# EAGLE schematic hat_raspi_7segdis (EAGLE 9.6.2)
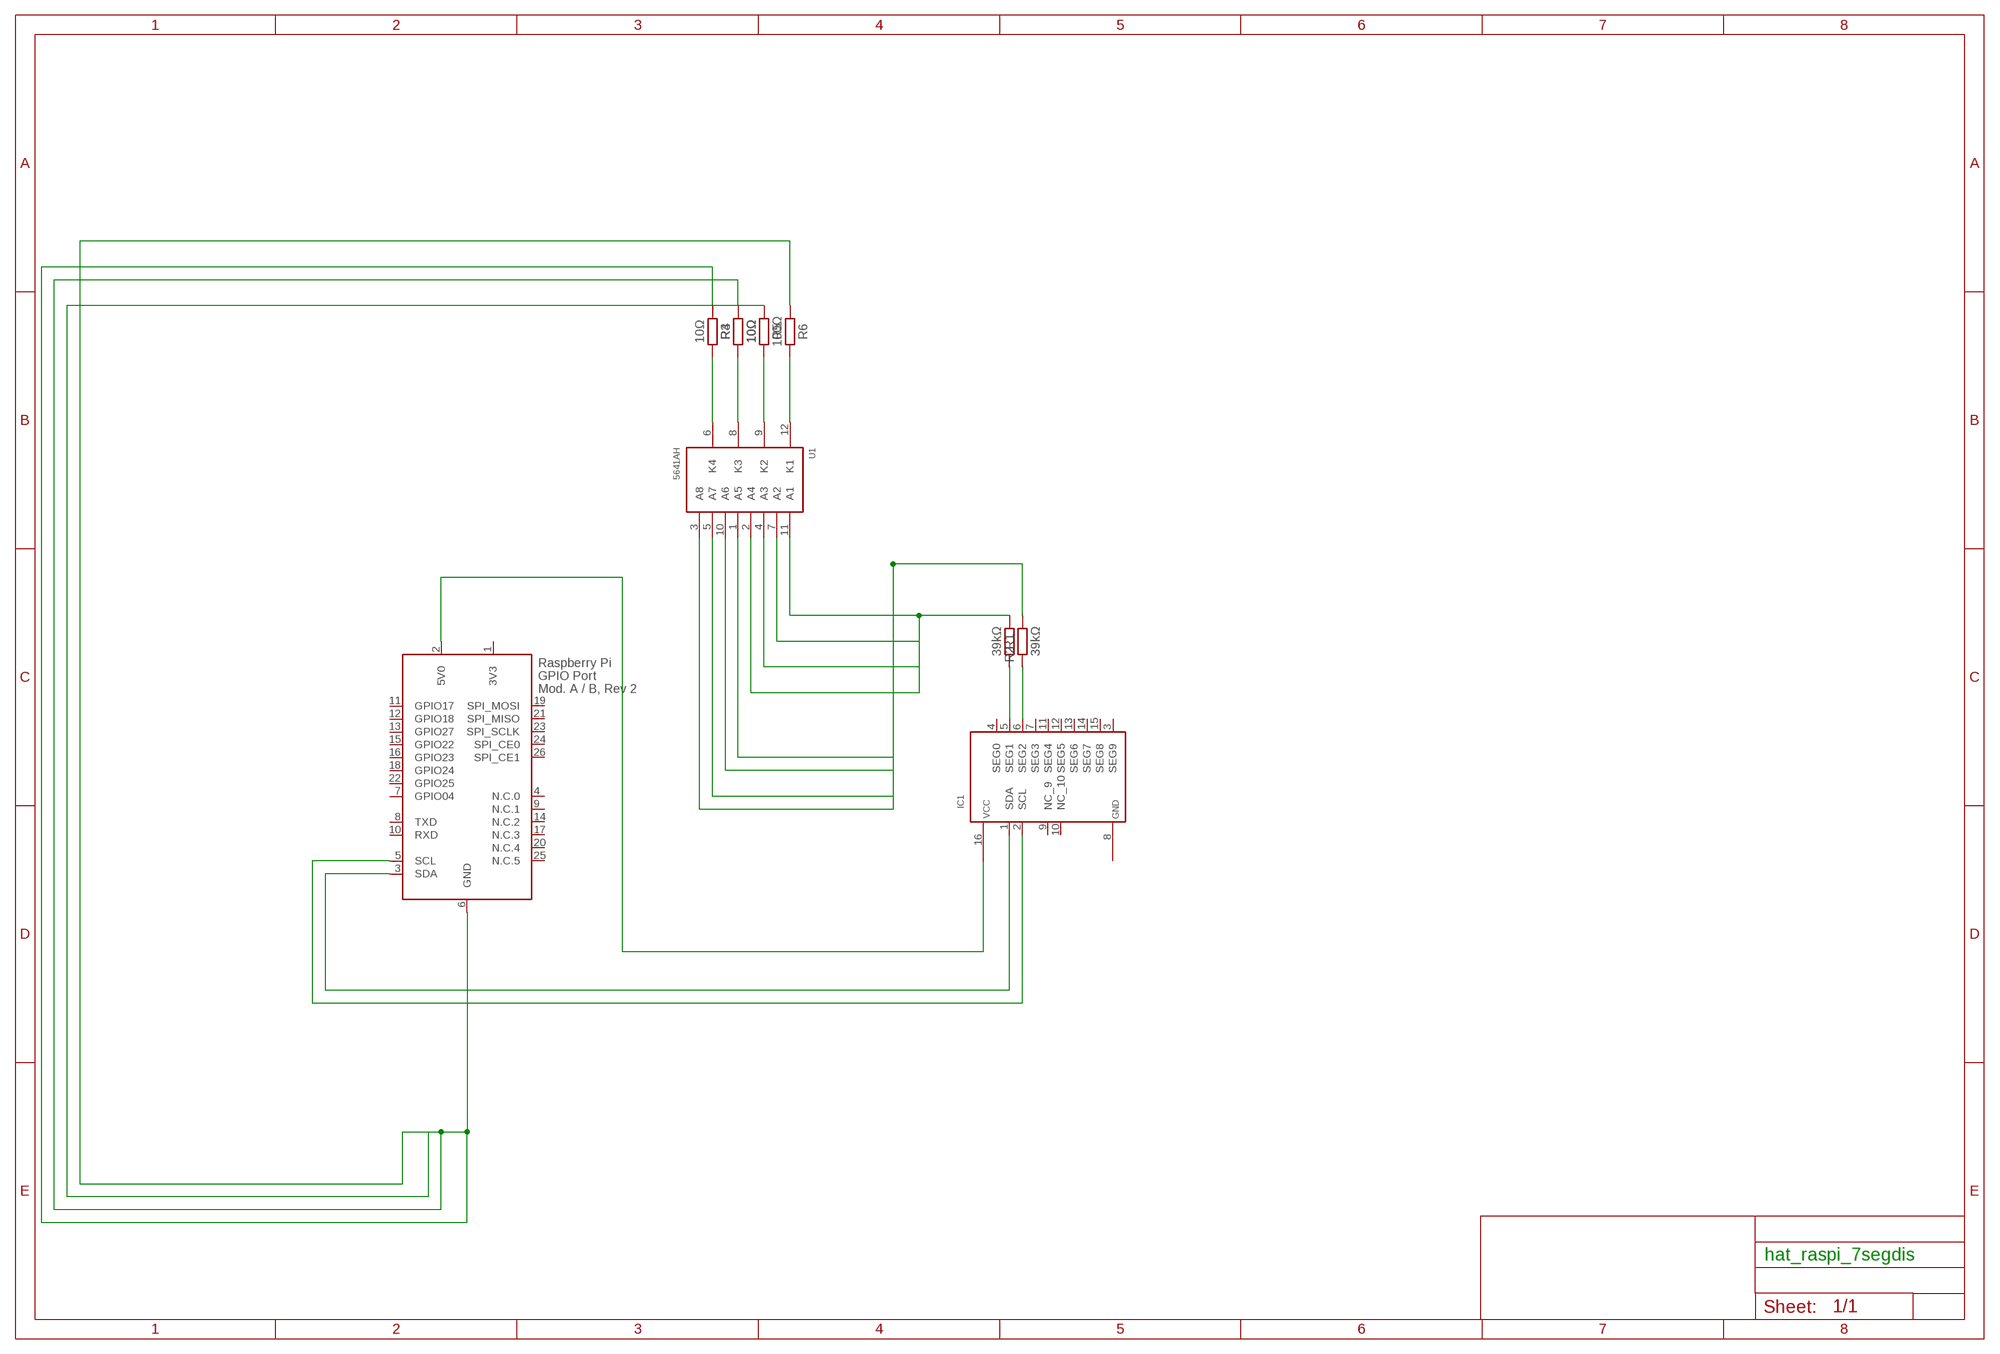
[diagram p0: schematic, sheet 1]

## Parts
IC1  MAX6958  [QSOP16]
R1  39kΩ  R_AXIAL-7.2MM-PITCH  [RESAD724W46L381D178B]
R2  39kΩ  R_AXIAL-7.2MM-PITCH  [RESAD724W46L381D178B]
R3  10Ω  R_AXIAL-7.2MM-PITCH  [RESAD724W46L381D178B]
R4  10Ω  R_AXIAL-7.2MM-PITCH  [RESAD724W46L381D178B]
R5  10Ω  R_AXIAL-7.2MM-PITCH  [RESAD724W46L381D178B]
R6  100Ω  R_AXIAL-7.2MM-PITCH  [RESAD724W46L381D178B]
U1  5641AH  [5642AH]
X1  RASPI_BOARD_AB_E2P  [RASPI_BOARD_AB_EDGES_2DRILL_PAD]

## Nets
N$1: R4.2 U1.6(K4)
N$2: R3.1 U1.8(K3)
N$3: R5.2 U1.9(K2)
N$4: R6.2 U1.12(K1)
N$5: R3.2 R4.1 R5.1 R6.1 X1.6(GND)
N$9: IC1.5(SEG1) R2.2
N$10: IC1.6(SEG2) R1.1
N$11: R2.1 U1.2(A4) U1.4(A3) U1.7(A2) U1.11(A1)
N$12: R1.2 U1.1(A5) U1.3(A8) U1.5(A7) U1.10(A6)
N$13: IC1.2(SCL) X1.5(SCL)
N$14: IC1.1(SDA) X1.3(SDA)
N$15: IC1.16(VCC) X1.2(5V0)
Unconnected: IC1.3(SEG9) IC1.4(SEG0) IC1.7(SEG3) IC1.9(NC_9) IC1.10(NC_10) IC1.11(SEG4) IC1.12(SEG5) IC1.13(SEG6) IC1.14(SEG7) IC1.15(SEG8) X1.4(N.C.0) X1.7(GPIO04) X1.8(TXD) X1.9(N.C.1) X1.10(RXD) X1.11(GPIO17) X1.12(GPIO18) X1.13(GPIO27) X1.14(N.C.2) X1.15(GPIO22) X1.16(GPIO23) X1.17(N.C.3) X1.18(GPIO24) X1.19(SPI_MOSI) X1.20(N.C.4) X1.21(SPI_MISO) X1.22(GPIO25) X1.23(SPI_SCLK) X1.24(SPI_CE0) X1.25(N.C.5) X1.26(SPI_CE1)

## Power pins joined to a net without a drawn wire
3V3: X1.1(3V3)
GND: IC1.8(GND)

## Library data of the parts
IC1 = hat_rpi_7segdisplay:MAX6958: MAX6958: 2-Wire Interfaced, 3V to 5.5V, 4-Digit, 9-Segment LED Display Drivers with Keyscan
R1-R6 = Resistor:R: Resistor Fixed - Generic; CATEGORY: Resistor; SUB-CATEGORY: Fixed
U1 = hat_rpi_7segdisplay:5641AH: 5641AH 0.56-inch Red (Ultra-Bright ) Common-Cathode (CC) 4-Digit LED 7-Segment Display XLITX Technology
X1 = hat_rpi_7segdisplay:RASPI_BOARD_AB: Raspberry Pi GPIO connector with markings for the outer dimensions of the Raspberry Pi board model A or B with different sets of drill holes or mounting pads for model B Revision 2.0